# Altium schematic sheet 01_Block_Diagram.SchDoc: Block diagram
size A4; Organization: Lime Microsystems; Address1: Surrey Tech Centre; Address2: Guildford GU2 7YG; Address3: Surrey; Address4: United Kingdom; Revision: v2.0; SheetNumber: 1; SheetTotal: 10
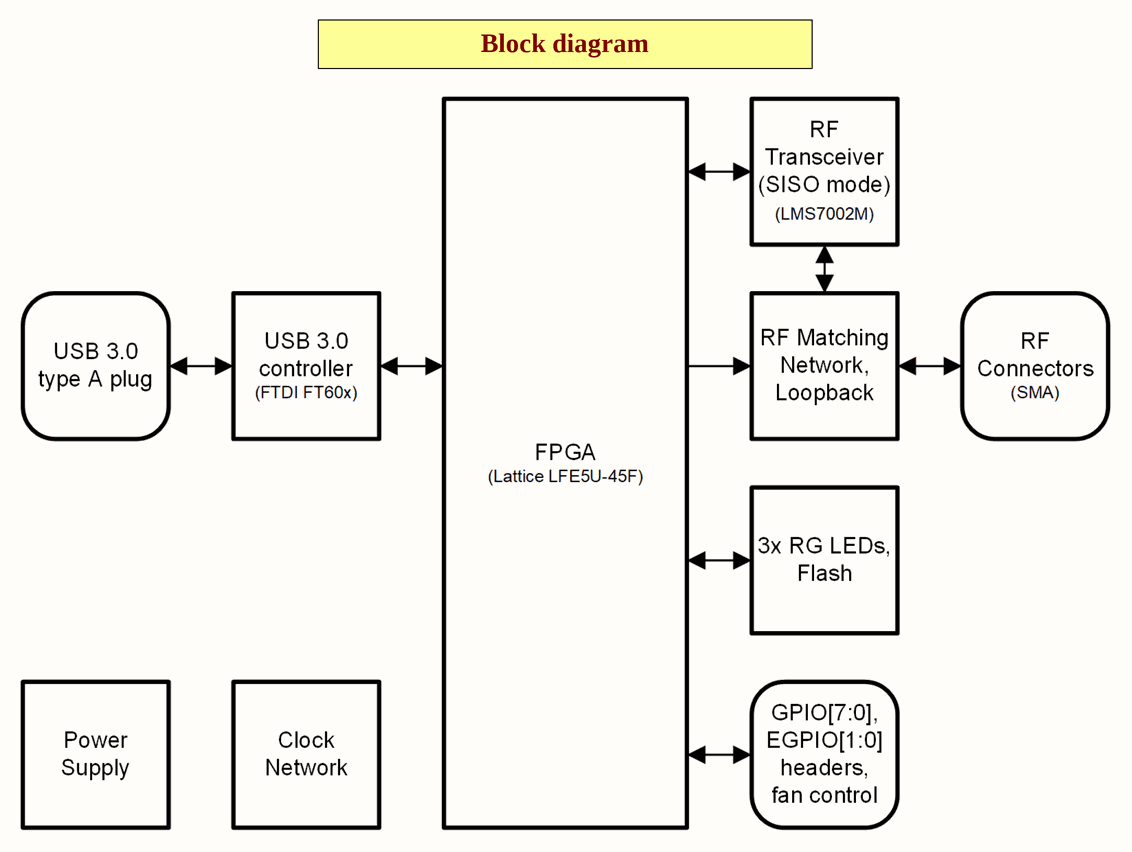
[diagram p0: 01_Block_Diagram.SchDoc]

## Notes on the sheet
- Block diagram
- Project name:
- Title:
- Size:
- Date:
- A4
- Revision:
- Time:
- Sheet
- of
- File: